# EAGLE schematic main (EAGLE 8.3.2)
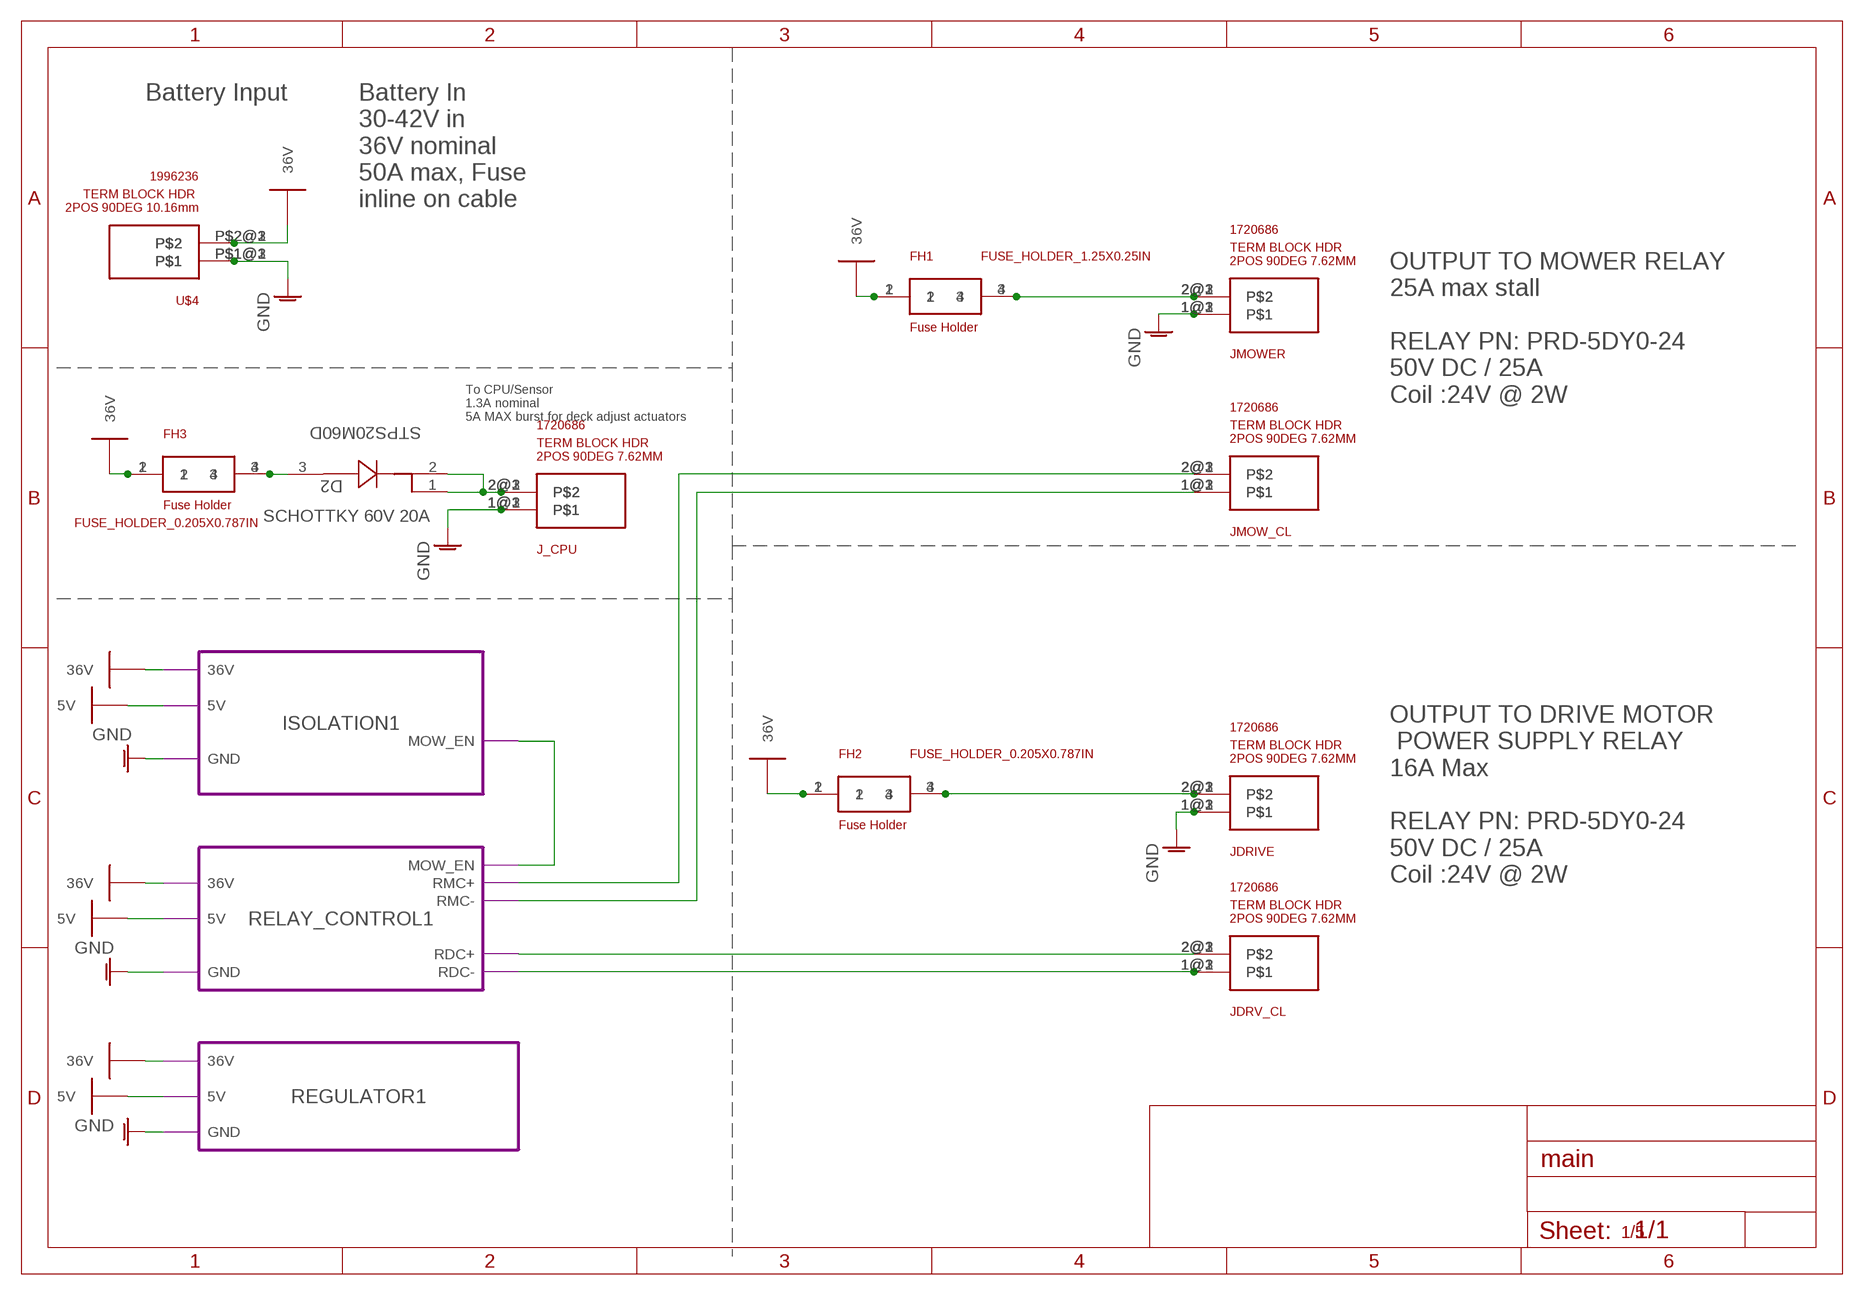
[diagram p0: schematic, sheet 1]

## Parts
D2  STPS20M60D  [TO220AC]
FH1  FUSE_HOLDER_1.25X0.25IN  [LF122_1.25IN]
FH2  FUSE_HOLDER_0.205X0.787IN  [LF445_0.807IN]
FH3  FUSE_HOLDER_0.205X0.787IN  [LF445_0.807IN]
J_CPU  1720686  [TERM-2POS-7.62MM-1720686]
JDRIVE  1720686  [TERM-2POS-7.62MM-1720686]
JDRV_CL  1720686  [TERM-2POS-7.62MM-1720686]
JMOW_CL  1720686  [TERM-2POS-7.62MM-1720686]
JMOWER  1720686  [TERM-2POS-7.62MM-1720686]
U$4  1996236  [TERM-2POS-10.16MM-1996236]

## Module instances
ISOLATION1 = ISO
RELAY_CONTROL1 = COIL
REGULATOR1 = REG

## Nets
5V: port RELAY_CONTROL1.5V ISOLATION1.5V REGULATOR1.5V
36V: FH1.1 FH1.2 FH2.1 FH2.2 FH3.1 FH3.2 U$4.P$2@1 U$4.P$2@2 U$4.P$2@3 ; port RELAY_CONTROL1.36V ISOLATION1.36V REGULATOR1.36V
GND: J_CPU.1@1 J_CPU.1@2 J_CPU.1@3 JDRIVE.1@1 JDRIVE.1@2 JDRIVE.1@3 JMOWER.1@1 JMOWER.1@2 JMOWER.1@3 U$4.P$1@1 U$4.P$1@2 U$4.P$1@3 ; port RELAY_CONTROL1.GND ISOLATION1.GND REGULATOR1.GND
N$2: JMOW_CL.2@1 ; port RELAY_CONTROL1.RMC+
N$4: JMOW_CL.1@1 ; port RELAY_CONTROL1.RMC-
N$5: port ISOLATION1.MOW_EN RELAY_CONTROL1.MOW_EN
N$6: JDRV_CL.2@1 ; port RELAY_CONTROL1.RDC+
N$7: JDRV_CL.1@1 JDRV_CL.1@2 JDRV_CL.1@3 ; port RELAY_CONTROL1.RDC-
N$8: FH1.3 FH1.4 JMOWER.2@1 JMOWER.2@2 JMOWER.2@3
N$9: FH2.3 FH2.4 JDRIVE.2@1 JDRIVE.2@2 JDRIVE.2@3
N$10: D2.1 D2.2 J_CPU.2@1 J_CPU.2@2 J_CPU.2@3
N$11: D2.3 FH3.3 FH3.4
Unconnected: JDRV_CL.2@2 JDRV_CL.2@3 JMOW_CL.1@2 JMOW_CL.1@3 JMOW_CL.2@2 JMOW_CL.2@3

## Notes on the sheet
- Battery Input
- Battery In
  30-42V in
  36V nominal
  50A max, Fuse 
  inline on cable
- OUTPUT TO MOWER RELAY
  25A max stall
  
  RELAY PN: PRD-5DY0-24
  50V DC / 25A
  Coil :24V @ 2W
- To CPU/Sensor
  1.3A nominal
  5A MAX burst for deck adjust actuators
- OUTPUT TO DRIVE MOTOR
   POWER SUPPLY RELAY
  16A Max
  
  RELAY PN: PRD-5DY0-24
  50V DC / 25A
  Coil :24V @ 2W
- 1/5

## Library data of the parts
D2 = discrete:STPS20M60D; DESCRIPTION: SCHOTTKY 60V 20A; MANUFACTURER: STMicroelectronics
FH1 = power_supplies:FUSE_HOLDER_1.25X0.25IN
FH2 FH3 = power_supplies:FUSE_HOLDER_0.205X0.787IN
J_CPU JDRIVE JDRV_CL JMOW_CL JMOWER = power_connectors:1720686
U$4 = power_connectors:1996236

## Module ISO
Ports: MOW_EN(io) GND(pwr) 5V(pwr) 36V(pwr)
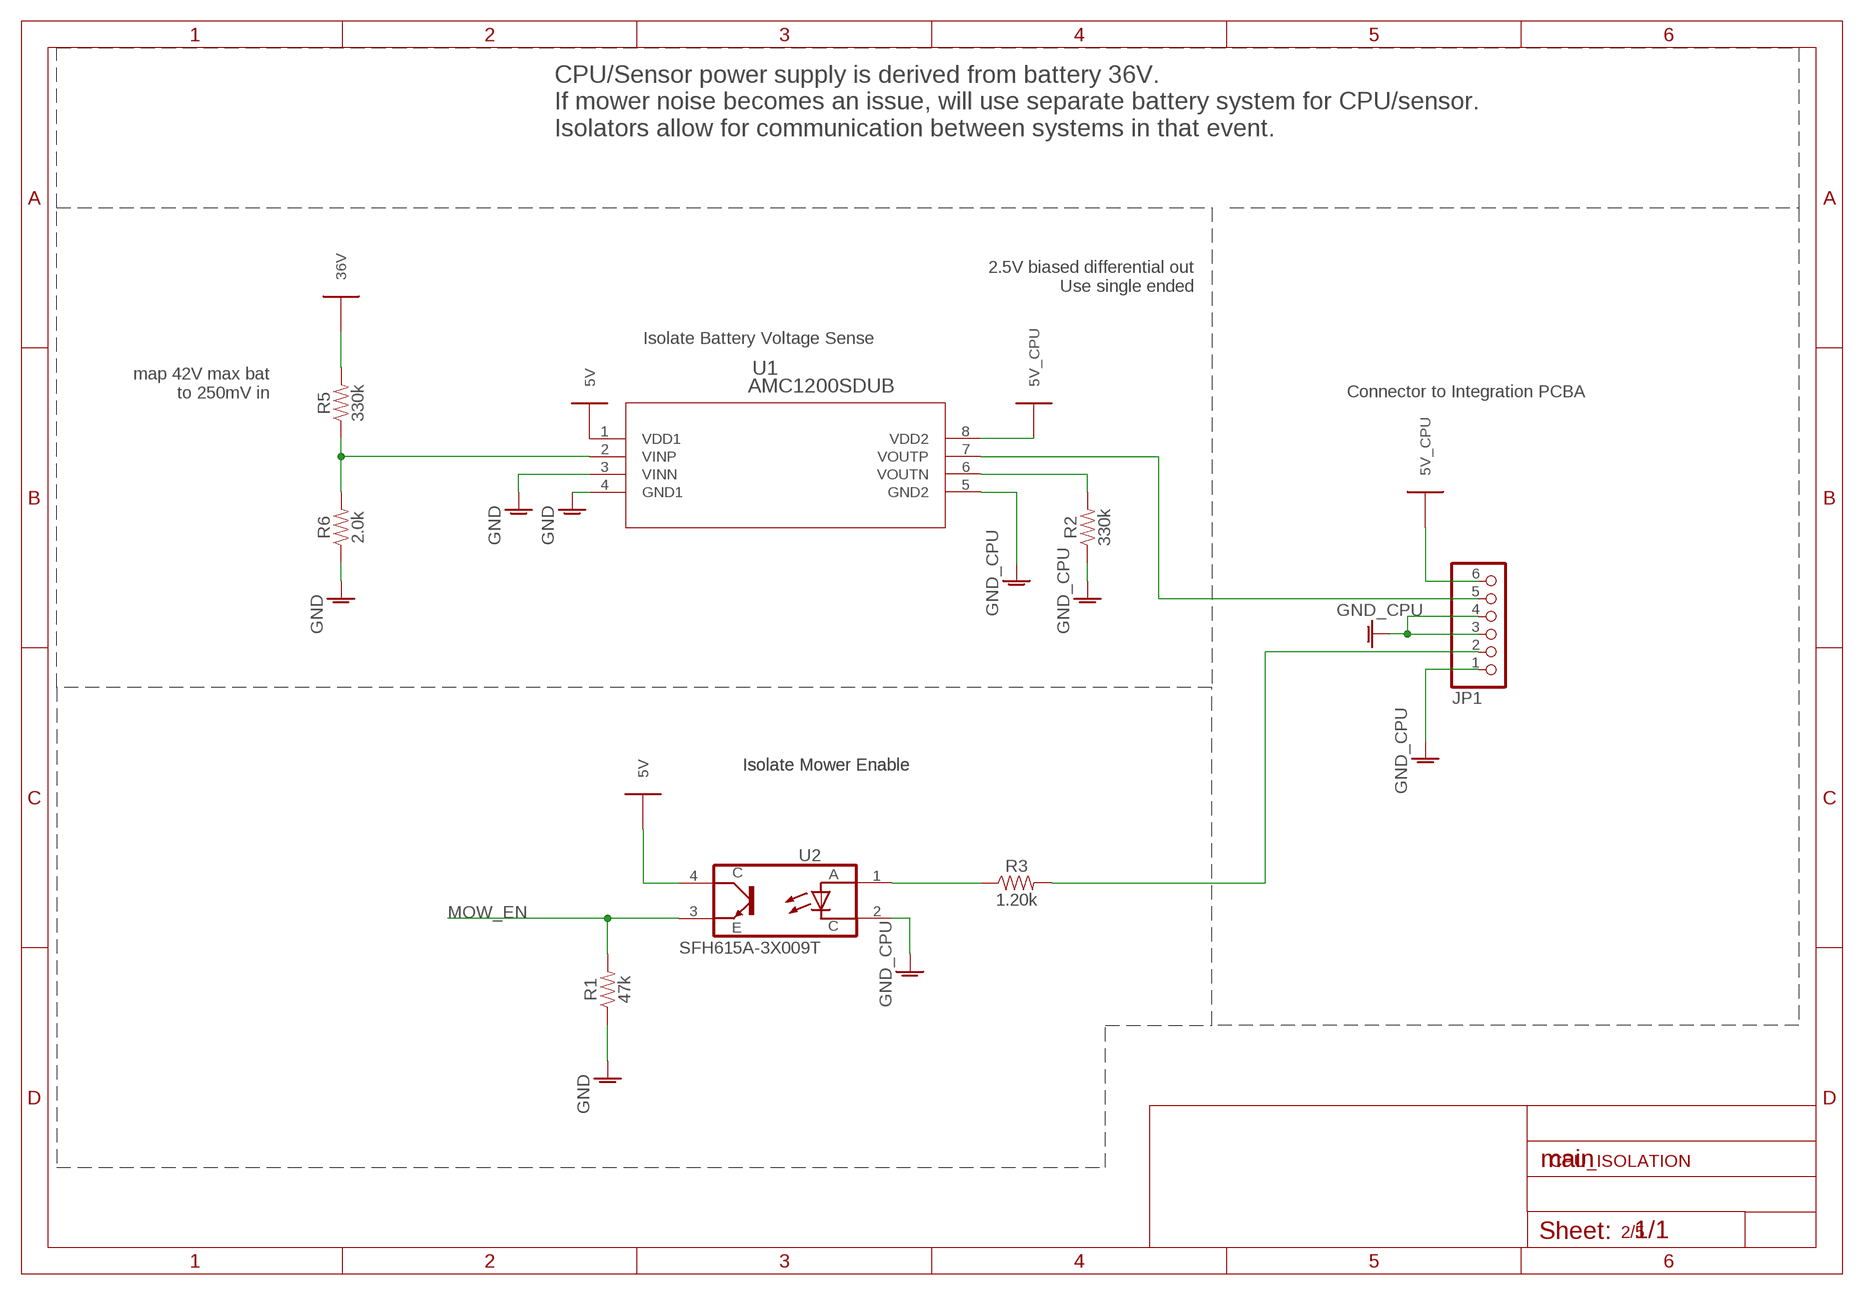
[diagram p1: schematic, module ISO, sheet 1]

### Parts
JP1  PINHD-1X6  [1X06]
R1  47k  47KOHM-0603-1/10W-1%  [0603]
R2  330k  330KOHM-0603-1/10W-1%  [0603]
R3  1.20k  1.20KOHM-0603-1/10W-1%  [0603]
R5  330k  330KOHM-0603-1/10W-1%  [0603]
R6  2.0k  2.0KOHM-0603-1/10W-5%  [0603]
U1  AMC1200SDUB  [DUB8]
U2  SFH615A-3X009T  [SOIC254P1016X390-4N]

### Nets
5V: U1.1(VDD1) U2.4(CO)
5V_CPU: JP1.6 U1.8(VDD2)
36V: R5.2
GND: R1.1 R6.1 U1.3(VINN) U1.4(GND1)
GND_CPU: JP1.1 JP1.3 JP1.4 R2.1 U1.5(GND2) U2.2(C)
MOW_EN: R1.2 U2.3(E)
N$1: R2.2 U1.6(VOUTN)
N$2: R5.1 R6.2 U1.2(VINP)
N$3: JP1.5 U1.7(VOUTP)
N$4: R3.1 U2.1(A)
N$5: JP1.2 R3.2

### Notes on the sheet
- CPU/Sensor power supply is derived from battery 36V.
  If mower noise becomes an issue, will use separate battery system for CPU/sensor.
  Isolators allow for communication between systems in that event.
- 2.5V biased differential out
  Use single ended
- Isolate Battery Voltage Sense
- map 42V max bat
  to 250mV in
- Connector to Integration PCBA
- Isolate Mower Enable | Isolate Mower Enable
- CPU_ISOLATION
- 2/5

### Library data of the parts
JP1 = pinhead:PINHD-1X6: PIN HEADER
R1 = SparkFun-Resistors:47KOHM: 47kΩ resistor A resistor is a passive two-terminal electrical component that implements electrical resistance as a circuit element. Resistors act to reduce current flow, and, at the same time, act to lower voltage levels within circuits. - Wikipedia; PROD_ID: RES-07871
R2 R5 = SparkFun-Resistors:330KOHM: 330kΩ resistor A resistor is a passive two-terminal electrical component that implements electrical resistance as a circuit element. Resistors act to reduce current flow, and, at the same time, act to lower voltage levels within circuits. - Wikipedia; PROD_ID: RES-08968
R3 = SparkFun-Resistors:1.20KOHM: 1.20kΩ resistor A resistor is a passive two-terminal electrical component that implements electrical resistance as a circuit element. Resistors act to reduce current flow, and, at the same time, act to lower voltage levels within circuits. - Wikipedia; PROD_ID: RES-08413
R6 = SparkFun-Resistors:2.0KOHM: 2kΩ resistor A resistor is a passive two-terminal electrical component that implements electrical resistance as a circuit element. Resistors act to reduce current flow, and, at the same time, act to lower voltage levels within circuits. - Wikipedia; PROD_ID: RES-08296
U1 = power_supplies:AMC1200SDUB; MANUFACTURER_PART_NUMBER: AMC1200SDUB; VENDOR: Texas Instruments
U2 = SFH615A-3X009T:SFH615A-3X009T; AVAILABILITY: Good; DESCRIPTION: Optocoupler DC-IN 1-CH Transistor DC-OUT 4-Pin PDIP SMD T/R; MF: Vishay Semiconductor; MP: SFH615A-3X009T; PACKAGE: SMD-4 Vishay; PRICE: 0.48 USD

## Module REG
Ports: 5V(pwr) 36V(pwr) GND(pwr)
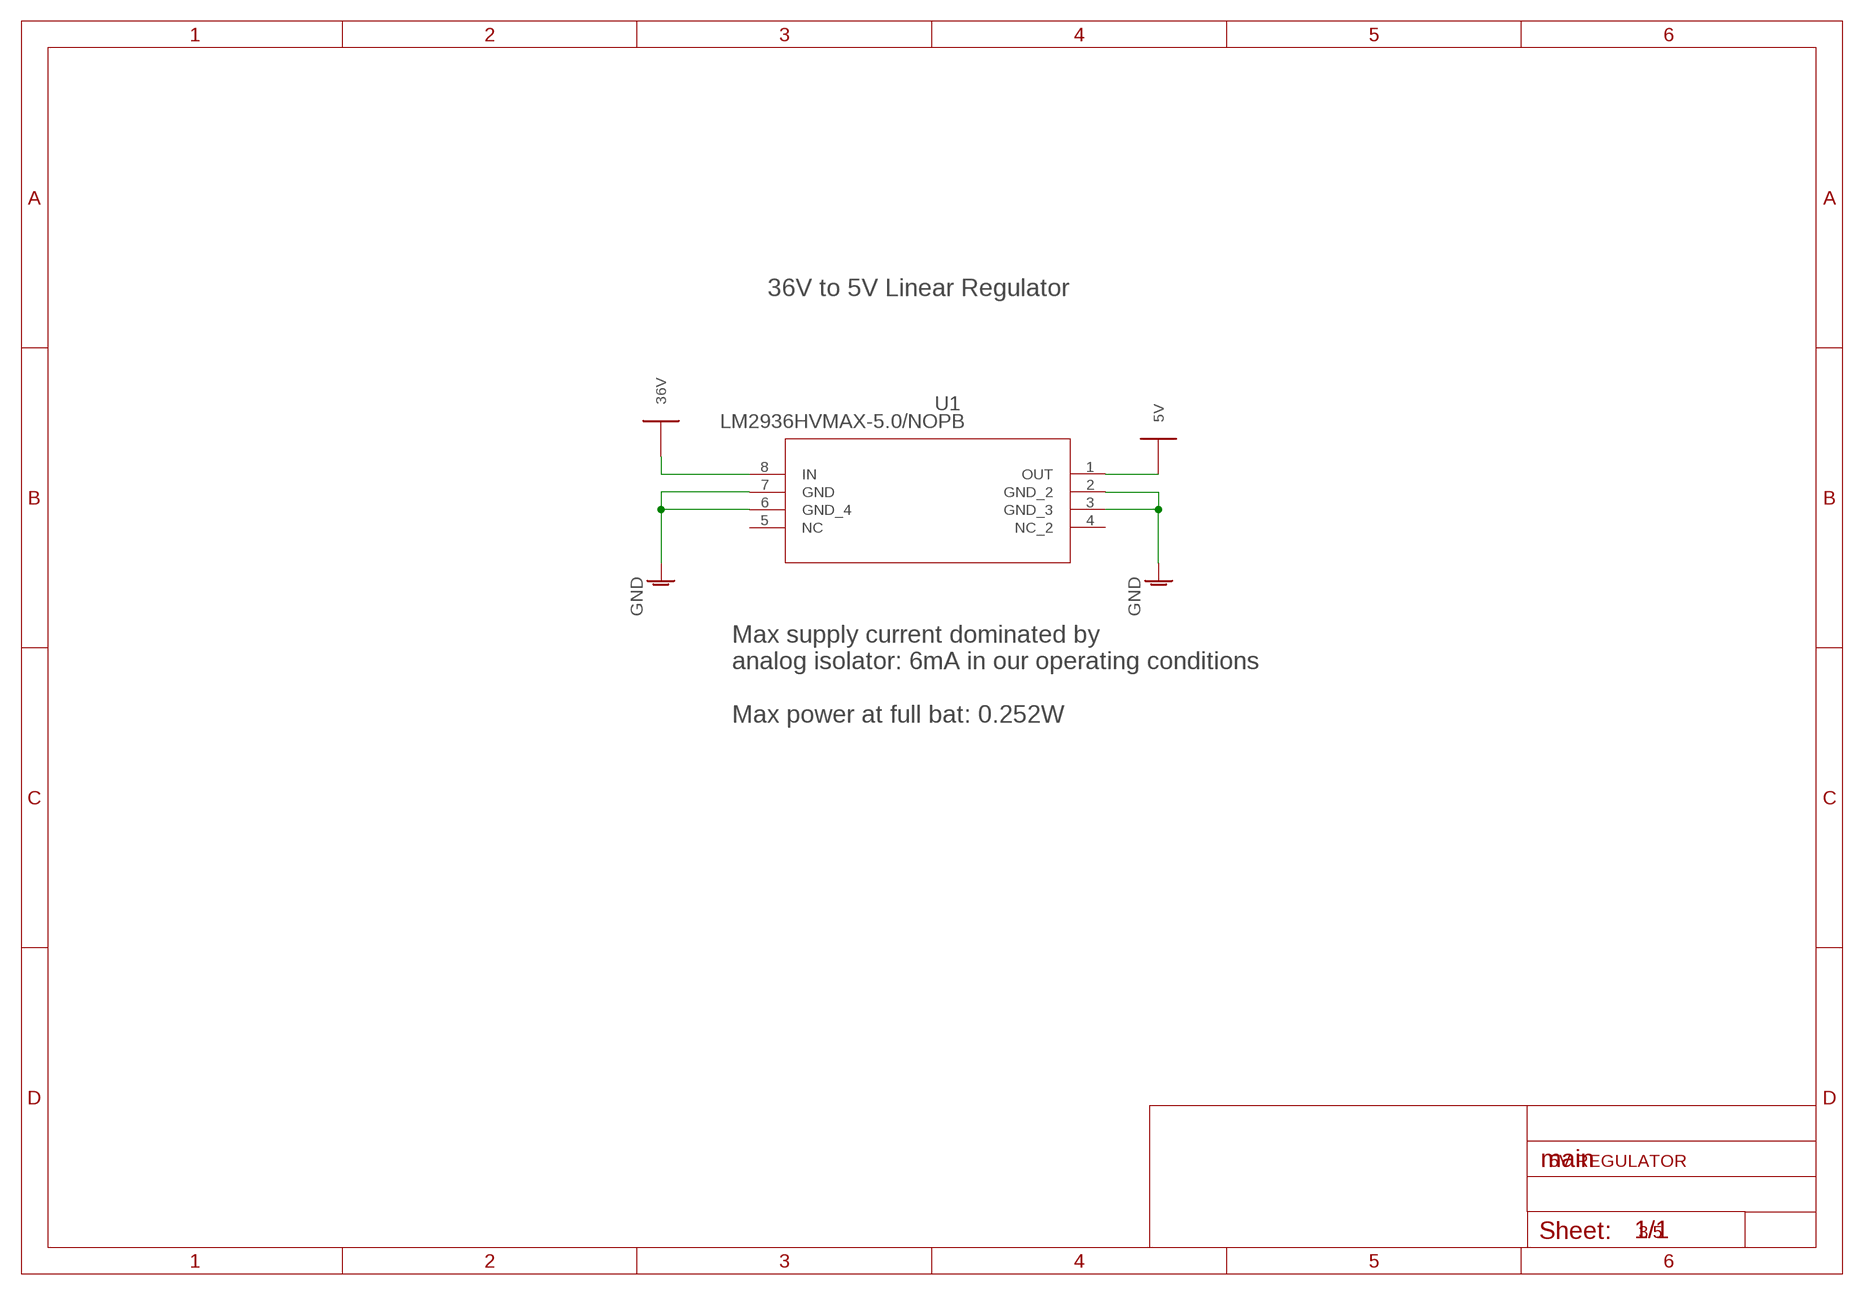
[diagram p2: schematic, module REG, sheet 1]

### Parts
U1  LM2936HVMAX-5.0/NOPB  [M08A]

### Nets
5V: U1.1(OUT)
36V: U1.8(IN)
GND: U1.2(GND_2) U1.3(GND_3) U1.6(GND_4) U1.7(GND)
Unconnected: U1.4(NC_2) U1.5(NC)

### Notes on the sheet
- 36V to 5V Linear Regulator
- Max supply current dominated by
  analog isolator: 6mA in our operating conditions
  
  Max power at full bat: 0.252W
- 5V REGULATOR
- 3/5

### Library data of the parts
U1 = power_supplies:LM2936HVMAX-5.0/NOPB; MANUFACTURER_PART_NUMBER: LM2936HVMAX5.0NOPB; VENDOR: Texas Instruments

## Module UVLO
Ports: !UVLO!(io) 5V(pwr) 36V(pwr) GND(pwr)
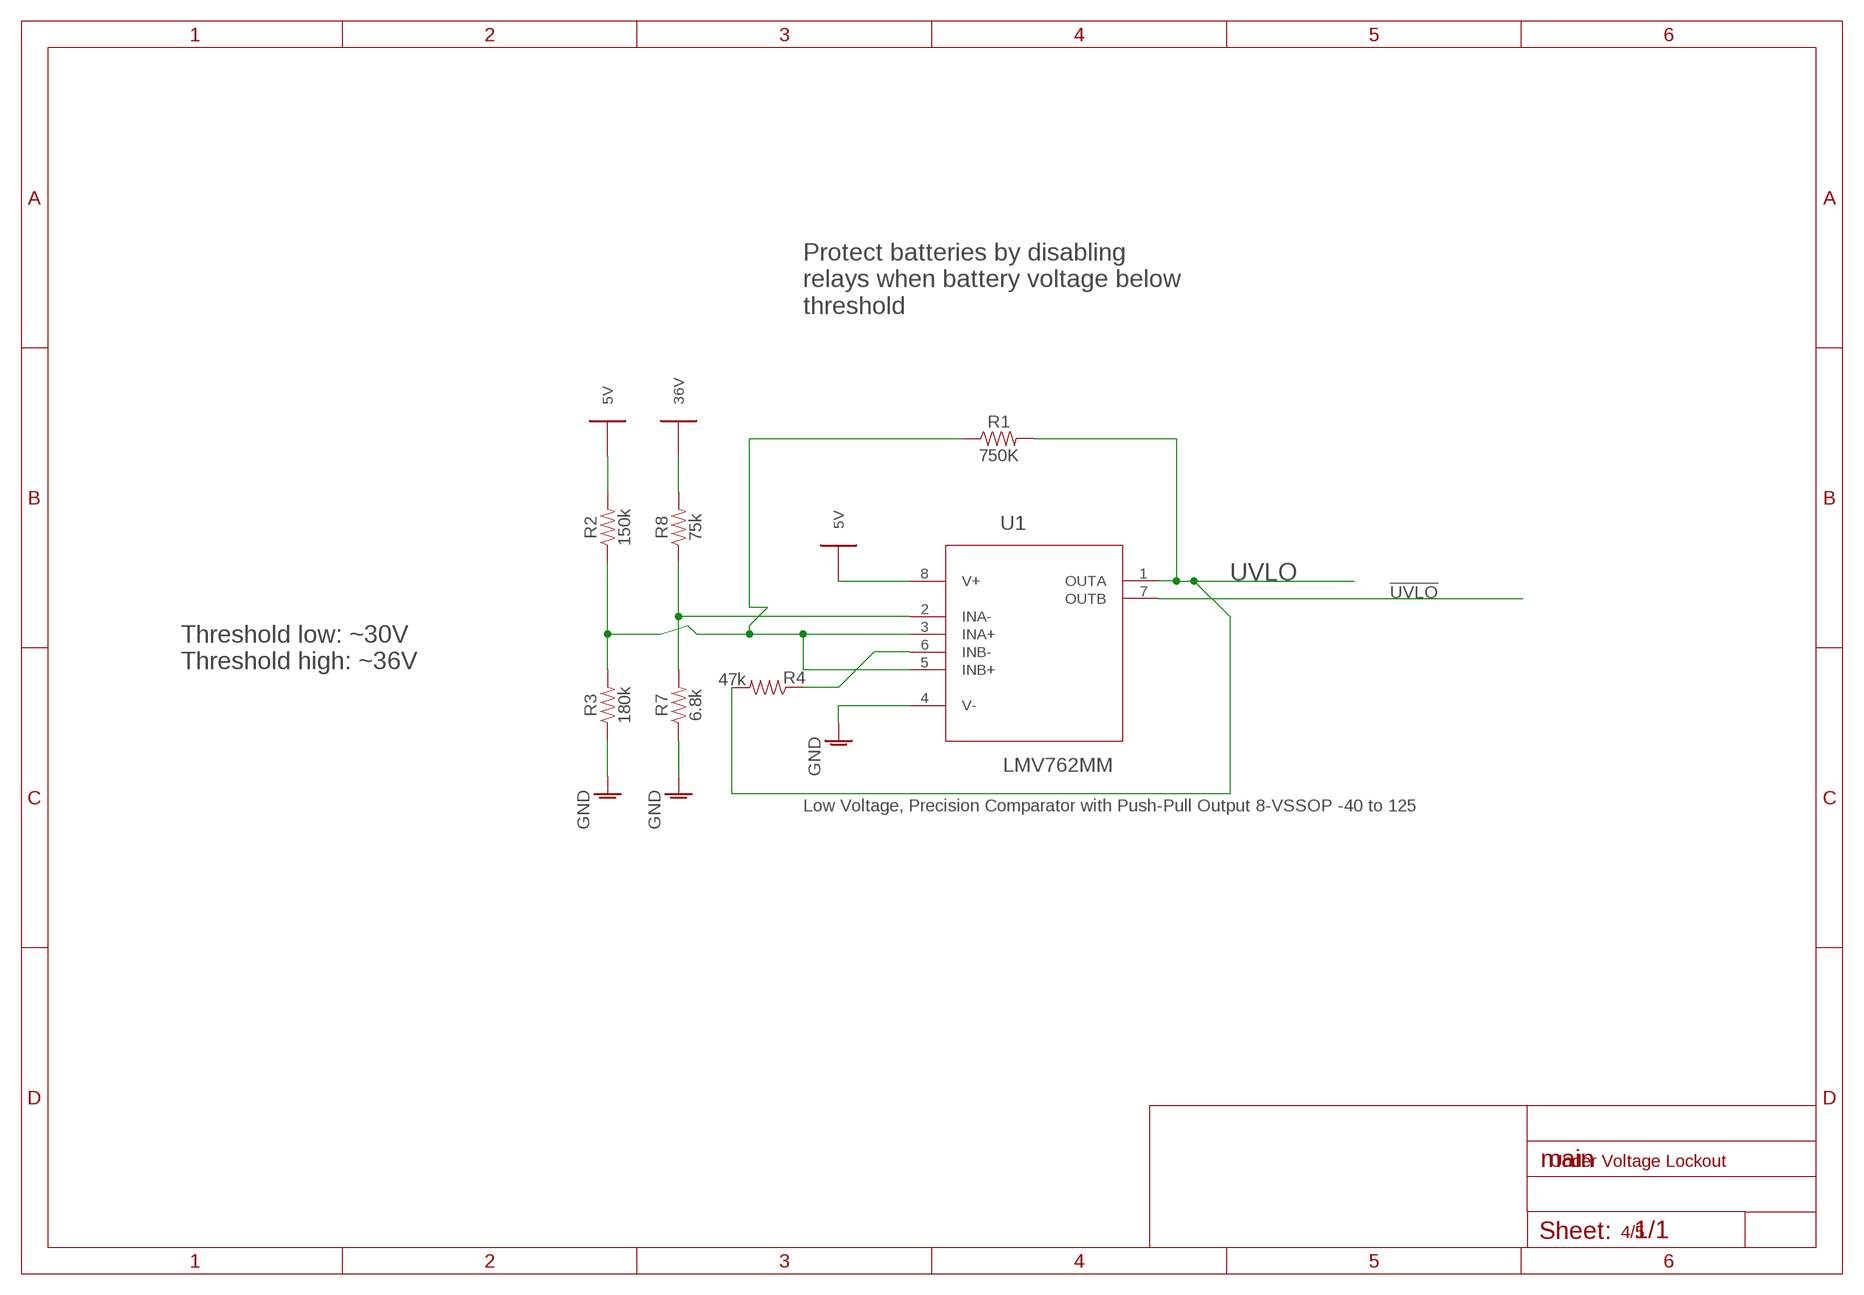
[diagram p3: schematic, module UVLO, sheet 1]

### Parts
R1  750K  750KOHM-0603-1/10W-1%  [0603]
R2  150k  150KOHM-0603-1/10W-1%  [0603]
R3  180k  180KOHM-0603-1/10W-1%  [0603]
R4  47k  47KOHM-0603-1/10W-1%  [0603]
R7  6.8k  6.8KOHM-0603-1/10W-1%  [0603]
R8  75k  75KOHM-0603-1/10W-1%  [0603]
U1  LMV762MM  [SOP65P490X110-8N]

### Nets
5V: R2.2 U1.8(V+)
36V: R8.2
!UVLO!: U1.7(OUTB)
GND: R3.1 R7.1 U1.4(V-)
N$2: R4.1 U1.6(INB-)
N$3: R1.1 R2.1 R3.2 U1.3(INA+) U1.5(INB+)
N$4: R7.2 R8.1 U1.2(INA-)
UVLO: R1.2 R4.2 U1.1(OUTA)

### Notes on the sheet
- Protect batteries by disabling
  relays when battery voltage below
  threshold
- Threshold low: ~30V
  Threshold high: ~36V
- Under Voltage Lockout
- 4/5

### Library data of the parts
R1 = SparkFun-Resistors:750KOHM: 750Ω resistor A resistor is a passive two-terminal electrical component that implements electrical resistance as a circuit element. Resistors act to reduce current flow, and, at the same time, act to lower voltage levels within circuits. - Wikipedia; PROD_ID: RES-13768
R2 = SparkFun-Resistors:150KOHM: 150kΩ resistor A resistor is a passive two-terminal electrical component that implements electrical resistance as a circuit element. Resistors act to reduce current flow, and, at the same time, act to lower voltage levels within circuits. - Wikipedia; PROD_ID: RES-09117
R3 = SparkFun-Resistors:180KOHM: RES-10066; PROD_ID: RES-10066
R4 = SparkFun-Resistors:47KOHM: 47kΩ resistor A resistor is a passive two-terminal electrical component that implements electrical resistance as a circuit element. Resistors act to reduce current flow, and, at the same time, act to lower voltage levels within circuits. - Wikipedia; PROD_ID: RES-07871
R7 = SparkFun-Resistors:6.8KOHM: 6.8kΩ resistor A resistor is a passive two-terminal electrical component that implements electrical resistance as a circuit element. Resistors act to reduce current flow, and, at the same time, act to lower voltage levels within circuits. - Wikipedia; PROD_ID: RES-08597
R8 = SparkFun-Resistors:75KOHM: 75Ω resistor A resistor is a passive two-terminal electrical component that implements electrical resistance as a circuit element. Resistors act to reduce current flow, and, at the same time, act to lower voltage levels within circuits. - Wikipedia; PROD_ID: RES-09737; VALUE: 75
U1 = LMV762MM:LMV762MM: Low Voltage, Precision Comparator; AVAILABILITY: Good; DESCRIPTION: Low Voltage, Precision Comparator with Push-Pull Output 8-VSSOP -40 to 125; MF: Texas Instruments; MP: LMV762MM/NOPB; PACKAGE: MSOP-8 Texas Instruments; PRICE: 1.26 USD

## Module COIL
Ports: MOW_EN(io) RDC+(io) RDC-(io) RMC+(io) RMC-(io) GND(pwr) 36V(pwr) 5V(pwr)
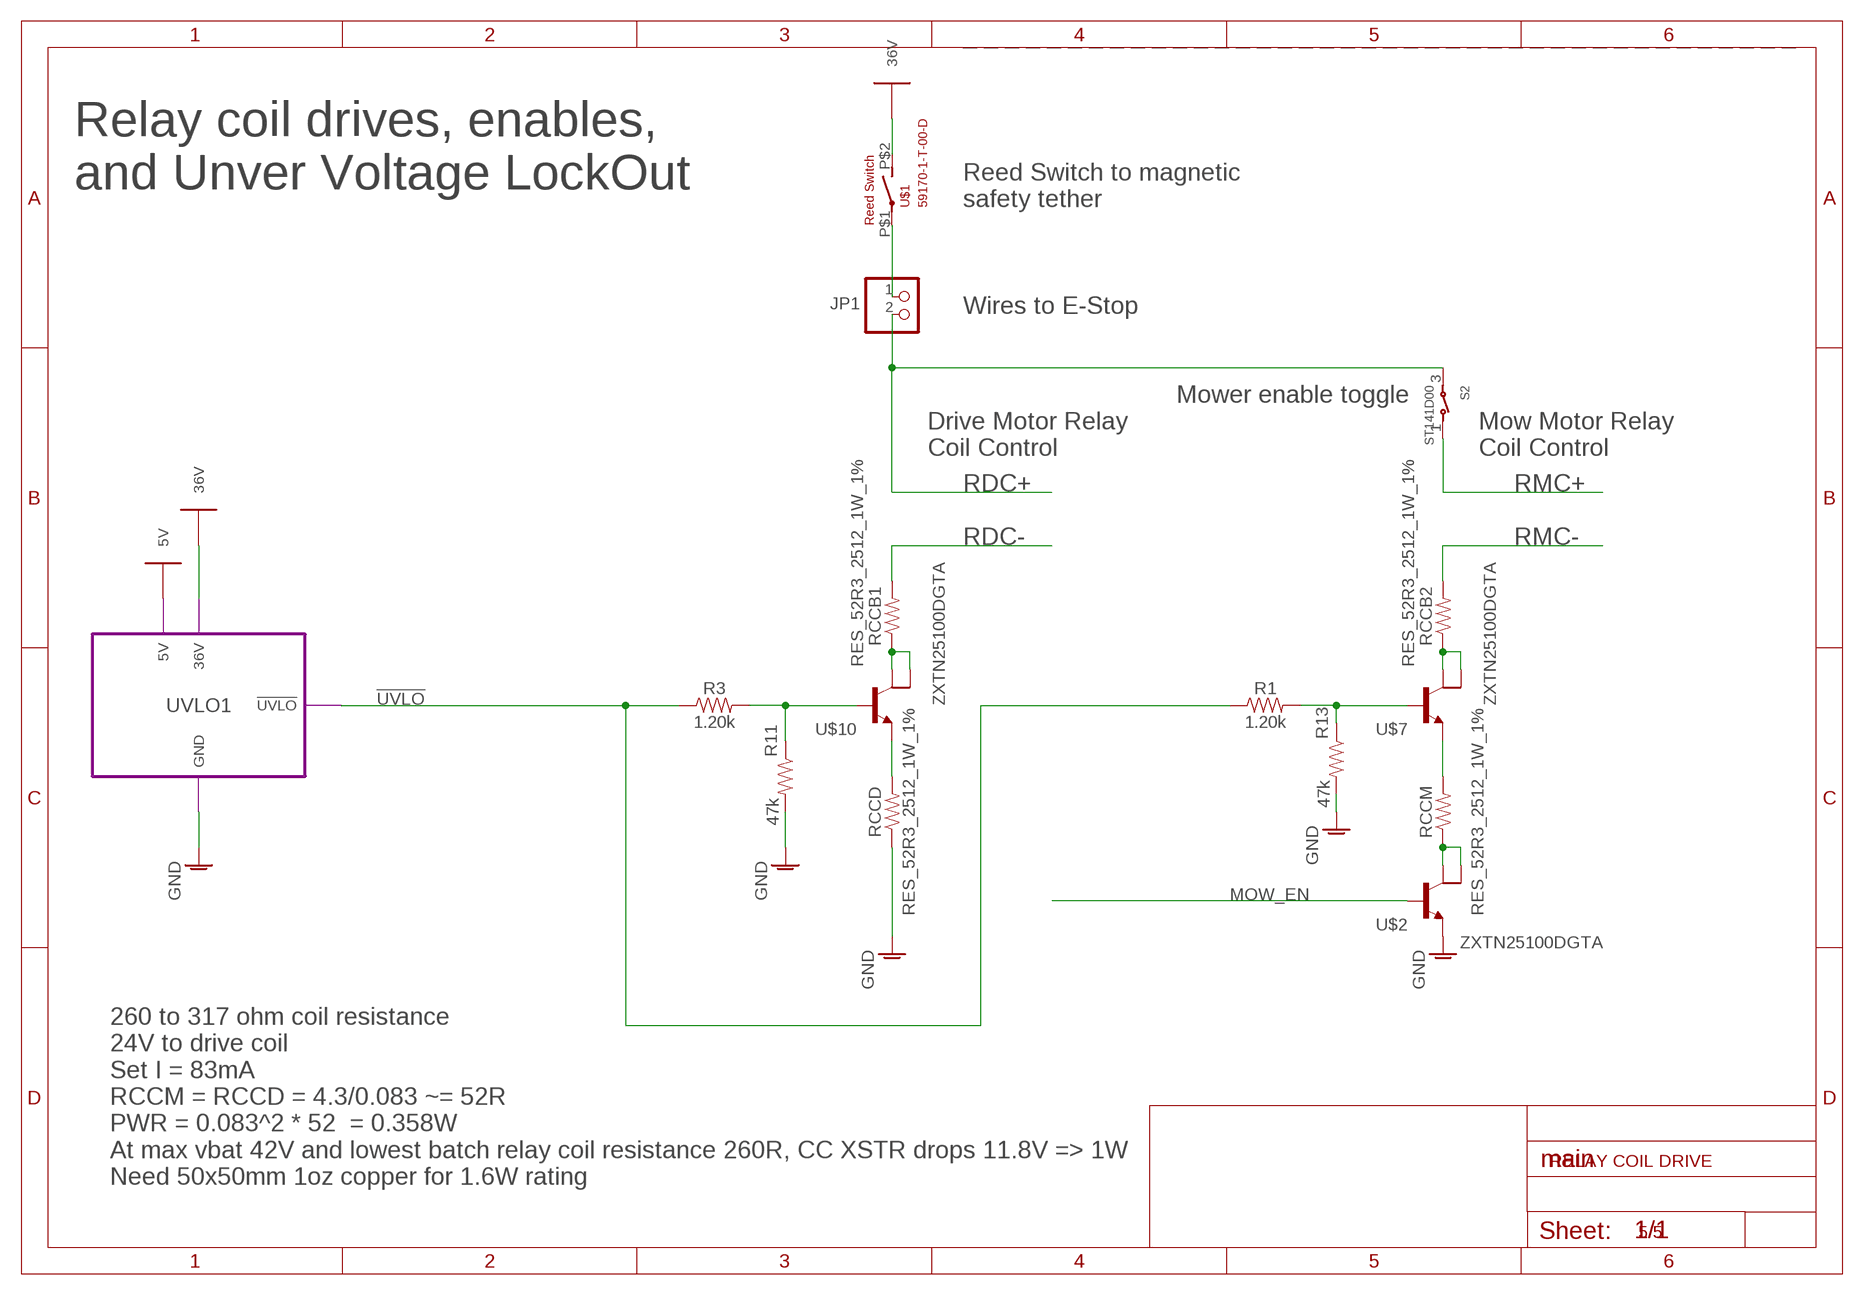
[diagram p4: schematic, module COIL, sheet 1]

### Parts
JP1  PINHD-1X2  [1X02]
R1  1.20k  1.20KOHM-0603-1/10W-1%  [0603]
R3  1.20k  1.20KOHM-0603-1/10W-1%  [0603]
R11  47k  47KOHM-0603-1/10W-1%  [0603]
R13  47k  47KOHM-0603-1/10W-1%  [0603]
RCCB1  RES_52R3_2512_1W_1%  [R2512]
RCCB2  RES_52R3_2512_1W_1%  [R2512]
RCCD  RES_52R3_2512_1W_1%  [R2512]
RCCM  RES_52R3_2512_1W_1%  [R2512]
S2  ST141D00  [SW_ST141D00]
U$1  59170-1-T-00-D  [59170-1-T-00-D-SMT]
U$2  ZXTN25100DGTA  [SOT230P700X160-4N]
U$7  ZXTN25100DGTA  [SOT230P700X160-4N]
U$10  ZXTN25100DGTA  [SOT230P700X160-4N]

### Module instances
UVLO1 = UVLO

### Nets
5V: port UVLO1.5V
36V: U$1.P$2(S) ; port UVLO1.36V
!UVLO!: R1.1 R3.1 ; port UVLO1.!UVLO!
GND: R11.2 R13.2 RCCD.1 U$2.3(E) ; port UVLO1.GND
MOW_EN: U$2.1(B)
N$1: JP1.1 U$1.P$1(P)
N$2: RCCM.1 U$2.2(C) U$2.4(C2)
N$5: RCCB2.1 U$7.2(C) U$7.4(C2)
N$6: RCCM.2 U$7.3(E)
N$7: R3.2 R11.1 U$10.1(B)
N$9: RCCD.2 U$10.3(E)
N$10: RCCB1.1 U$10.2(C) U$10.4(C2)
N$11: R1.2 R13.1 U$7.1(B)
RDC+: JP1.2 S2.3
RDC-: RCCB1.2
RMC+: S2.1
RMC-: RCCB2.2

### Notes on the sheet
- Relay coil drives, enables,
  and Unver Voltage LockOut
- Reed Switch to magnetic
  safety tether
- Wires to E-Stop
- Mower enable toggle
- Drive Motor Relay
  Coil Control
- Mow Motor Relay
  Coil Control
- RELAY COIL DRIVE
- 260 to 317 ohm coil resistance
  24V to drive coil
  Set I = 83mA
  RCCM = RCCD = 4.3/0.083 ~= 52R
  PWR = 0.083^2 * 52  = 0.358W 
  At max vbat 42V and lowest batch relay coil resistance 260R, CC XSTR drops 11.8V => 1W
  Need 50x50mm 1oz copper for 1.6W rating
- 5/5

### Library data of the parts
JP1 = pinhead:PINHD-1X2: PIN HEADER
R1 R3 = SparkFun-Resistors:1.20KOHM: 1.20kΩ resistor A resistor is a passive two-terminal electrical component that implements electrical resistance as a circuit element. Resistors act to reduce current flow, and, at the same time, act to lower voltage levels within circuits. - Wikipedia; PROD_ID: RES-08413
R11 R13 = SparkFun-Resistors:47KOHM: 47kΩ resistor A resistor is a passive two-terminal electrical component that implements electrical resistance as a circuit element. Resistors act to reduce current flow, and, at the same time, act to lower voltage levels within circuits. - Wikipedia; PROD_ID: RES-07871
RCCB1 RCCB2 RCCD RCCM = passive:RES_52R3_2512_1W_1%; DESCRIPTION: RES SMD 52.3 OHM 1% 1W 2512; MANUFACTURER: Rohm; PART_NUMBER: MCR100JZHF52R3
S2 = ST141D00:ST141D00: ST1 Series SP Off-On Through Hole High Amp Toggle Switch; AVAILABILITY: Good; DESCRIPTION: ST1 Series SP Off-On Through Hole High Amp Toggle Switch; MF: E-Switch; MP: ST141D00; PACKAGE: None; PRICE: 3.46 USD
U$1 = discrete:59170-1-T-00-D
U$2 U$7 U$10 = discrete:ZXTN25100DGTA